# Altium schematic sheet ESenseFE.SchDoc
size C
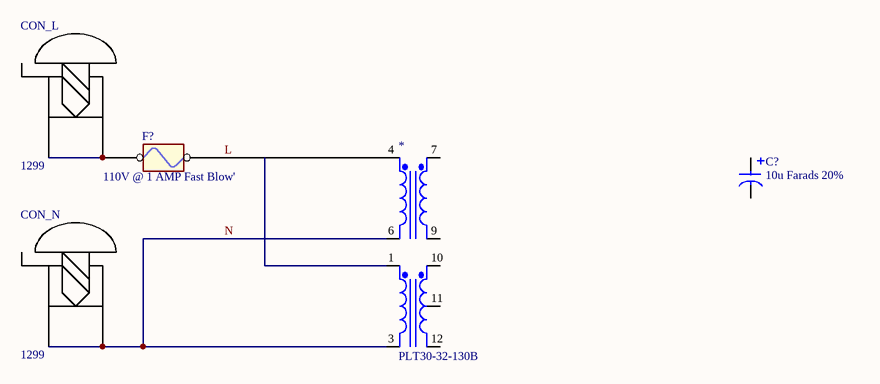
[diagram p0: ESenseFE.SchDoc]

## Parts
*  PLT30-32-130B  [TRANSFORMER-TRPLE-OUTPUT]
C?  10u Farads 20%  [CAP-SMD-POL-5mmDia]
CON_L  1299  [LOW-PROFILE-SCREWTERMINAL]
CON_N  1299  [LOW-PROFILE-SCREWTERMINAL]
F?  110V @ 1 AMP Fast Blow'  [WICKMANN/WK0011-ND]

## Nets
L: F?.2
N: *.3(Pri-) *.6(Pri-) CON_N.1
NetCON_L_1: CON_L.1 F?.1

Not connected (* = marked no-connect by the designer): * 1(Pri+) 4(Pri+) 7(Sec+) 9(Sec-) 10(Sec+) 11(SecCT) 12(Sec-); C? 1 2

## Library data of the parts
* = 2176: transformers passive components; mfrName: Tamura; Extra_Description: TRANSF TRPL OUT 9.3/27.5 30VA / Mounting Type: ``Through Hole`` / Packaging: ``Bulk`` / Size-Width: { / ``uncertainty_minus``: null, / ``value``: 0.055575, / ``uncertainty_plus``: null / } / Size-Length: { / ``uncertainty_minus``: null, / ``value``: 0.066675, / ``uncertainty_plus``: null / } / Size-Height: { / ``uncertainty_minus``: null, / ``value``: 0.0397, / ``uncertainty_plus``: null / } / Weight: { / ``uncertainty_minus``: null, / ``value``: 521.631, / ``uncertainty_plus``: null / } / Frequency: { / ``max_value``: 60.0, / ``max_uncertainty_plus``: null, / ``min_value``: null, / ``min_uncertainty_plus``: null, / ``max_uncertainty_minus``: null / } / Output Power: { / ``max_value``: 30.0, / ``max_uncertainty_plus``: null, / ``min_value``: null, / ``min_uncertainty_plus``: null, / ``max_uncertainty_minus``: null / }; Obsolete: False; Temp_Max: 0; TypeNotes: Applies to all parts in the database; PartID: 2176; mfrPartNum: PLT30-32-130B; URL_Image: http://cdn.sigma.octopart.com/9050038/image/Tamura-PLT30-32-130B.jpg; URL_Datasheet: http://datasheet.octopart.com/PLT30-32-130B-Tamura-datasheet-146183.pdf; Date_Created: 5/5/2011 1:04:44 AM; Date_LastModified: 5/5/2011 1:04:44 AM; Verified: False; RoHS: True; Temp_Min: 0; Type: All Parts
C? = 2178: capacitor, case c, 10uf, 25v; application:general purpose;; mfrName: Panasonic; mfrPartNum: EEE1EA100SR; Label: 1uF; Extra_Description: CAPACITOR, CASE C, 10UF, 25V; Application:General Purpose; Capacitance:10µF; Tolerance, Capacitance:± 20%; Series:VS; Voltage, Rating:25V dc; Capacitor Dielectric Type:Aluminium Electrolytic; Case Style:C; External Length / Height:5.4mm; Body Diameter:5mm; Lead Spacing:1.5mm; Termination Type:SMD; Operating Temperature Range:-40°C to +85°C; AC Ripple Current:28mA; External Depth:5.3mm; Lead Length:2.2mm; Leakage Current:3µA; Operating Lifetime:2000h; Power Factor:0.14; Power Factor Frequency:120Hz; Ripple Current Frequency:120Hz; Temp, Op. Max:85°C; Temp, Op. Min:-40°C; Temperature, Operating Life:85°C; Temperature, Ripple Current:85°C; Tolerance, +:20%; Tolerance, -:20%; Voltage Rating, DC:25V; Width, External:5.3mm; Width, Lead Cross-section:0.65mm; Width, Tape:12mm / Mounting Type: ``Surface Mount`` / Lead-Free Status: ``Lead Free`` / Packaging: ``Cut Tape (CT)`` / Dielectric Material: ``Aluminum Electrolytic`` / RoHS: ``Compliant`` / Size-Height: { / ``uncertainty_minus``: null, / ``value``: 0.0054, / ``uncertainty_plus``: null / } / Voltage Rating (DC): { / ``uncertainty_minus``: null, / ``value``: 25.0, / ``uncertainty_plus``: null / } / Lead Length: { / ``uncertainty_minus``: null, / ``value``: 0.0022, / ``uncertainty_plus``: null / } / Size-Diameter: { / ``uncertainty_minus``: null, / ``value``: 0.005, / ``uncertainty_plus``: null / } / Capacitance: { / ``uncertainty_minus``: null, / ``value``: 1E-05, / ``uncertainty_plus``: null / } / Capacitance Tolerance: { / ``max_value``: 20.0, / ``max_uncertainty_plus``: null, / ``min_value``: -20.0, / ``min_uncertainty_plus``: null, / ``max_uncertainty_minus``: null / } / Operating Temperature: { / ``max_value``: 85.0, / ``max_uncertainty_plus``: null, / ``min_value``: null, / ``min_uncertainty_plus``: null, / ``max_uncertainty_minus``: null / } / Number of Pins: 2; Obsolete: False; Temp_Max: 0; Type: All Parts; TypeNotes: Applies to all parts in the database; PartID: 2178; URL_Image: http://cdn.sigma.octopart.com/8896371/image/Panasonic-EEE1EA100SR.jpg; URL_Datasheet: http://datasheet.octopart.com/EEE1EA100SR-Panasonic-datasheet-5314063.pdf; Date_Created: 5/5/2011 2:23:52 AM; Date_LastModified: 5/5/2011 2:23:52 AM; Verified: False; RoHS: True; Temp_Min: 0
CON_L CON_N = 2177: brass tin plate low profile 10 - 32 thread with anti; mfrName: Keystone; Extra_Description: Brass Tin Plate Low Profile 10 - 32 Thread with Anti Rotation Tab Screw Terminal / Termination Style: ``Crimp`` / Material: ``Brass`` / Packaging: ``Bulk`` / Orientation: ``Straight`` / RoHS: ``Compliant`` / Lead-Free Status: ``Lead Free`` / Color: ``Black``; Obsolete: False; Temp_Max: 0; TypeNotes: Applies to all parts in the database; PartID: 2177; mfrPartNum: 1299; mfrWebsite: http://www.keyelco.com/; URL_Image: http://cdn.sigma.octopart.com/8947666/image/Keystone-1299.jpg; URL_Datasheet: http://datasheet.octopart.com/1299-Keystone-datasheet-23631.pdf; Date_Created: 5/5/2011 1:44:10 AM; Date_LastModified: 5/5/2011 1:44:10 AM; Verified: False; RoHS: True; Temp_Min: 0; Type: All Parts
F? = 1045: FUSEHOLDER OPEN 5X20MM PC MNT; mfrName: Wickmann USA, Inc.; mfrPartNum: 6490000100; Extra_Description: Wickmann USA, Inc. / TypeHolder / Fuse Size5mm x 20mm / MountingPCB / SpecificationsMiniature / MaterialThermoplastic, Black / Other Names19649 / 649 / WK0011; Type: Fuseholders; PartID: 1045; URL_Image: http://media.digikey.com/photos/Wickmann%20Photos/6490000100_sml.jpg; URL_Datasheet: http://www.digikey.com/scripts/DkSearch/dksus.dll?Pname?Name=WK0011-ND&Site=US; Date_Created: 8/1/2004 3:23:57 AM; Date_LastModified: 8/21/2009 1:12:53 AM; Verified: False